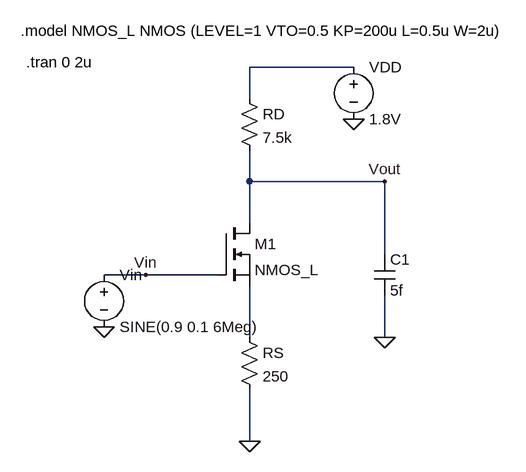
[diagram p0: schematic Lab2_Amplifer.asc]
Lab2_Amplifer.asc, the LTspice schematic file:
Version 4
SHEET 1 1456 688
WIRE 720 -112 560 -112
WIRE 560 -64 560 -112
WIRE 560 64 560 16
WIRE 768 64 560 64
WIRE 560 128 560 64
WIRE 768 176 768 64
WIRE 400 208 336 208
WIRE 512 208 400 208
WIRE 560 304 560 224
WIRE 768 304 768 240
WIRE 560 464 560 384
FLAG 768 304 0
FLAG 560 464 0
FLAG 400 208 Vin
FLAG 336 288 0
FLAG 720 -32 0
FLAG 768 64 Vout
SYMBOL nmos 512 128 R0
SYMATTR InstName M1
SYMATTR Value NMOS_L
SYMBOL res 544 -80 R0
SYMATTR InstName RD
SYMATTR Value 7.5k
SYMBOL res 544 288 R0
SYMATTR InstName RS
SYMATTR Value 250
SYMBOL voltage 336 192 R0
SYMATTR InstName Vin
SYMATTR Value SINE(0.9 0.1 6Meg)
SYMBOL voltage 720 -128 R0
SYMATTR InstName VDD
SYMATTR Value 1.8V
SYMBOL cap 752 176 R0
SYMATTR InstName C1
SYMATTR Value 5f
TEXT 208 -168 Left 2 !.model NMOS_L NMOS (LEVEL=1 VTO=0.5 KP=200u L=0.5u W=2u)
TEXT 216 -120 Left 2 !.tran 0 2u

The netlist it stands for:
* Lab2_Amplifer.asc
M1 Vout Vin N002 N002 NMOS_L
RD N001 Vout 7.5k
RS N002 0 250
Vin Vin 0 SINE(0.9 0.1 6Meg)
VDD N001 0 1.8V
C1 Vout 0 5f
.model NMOS NMOS
.model PMOS PMOS
.lib standard.mos
.model NMOS_L NMOS (LEVEL=1 VTO=0.5 KP=200u L=0.5u W=2u)
.tran 0 2u
.backanno
.end